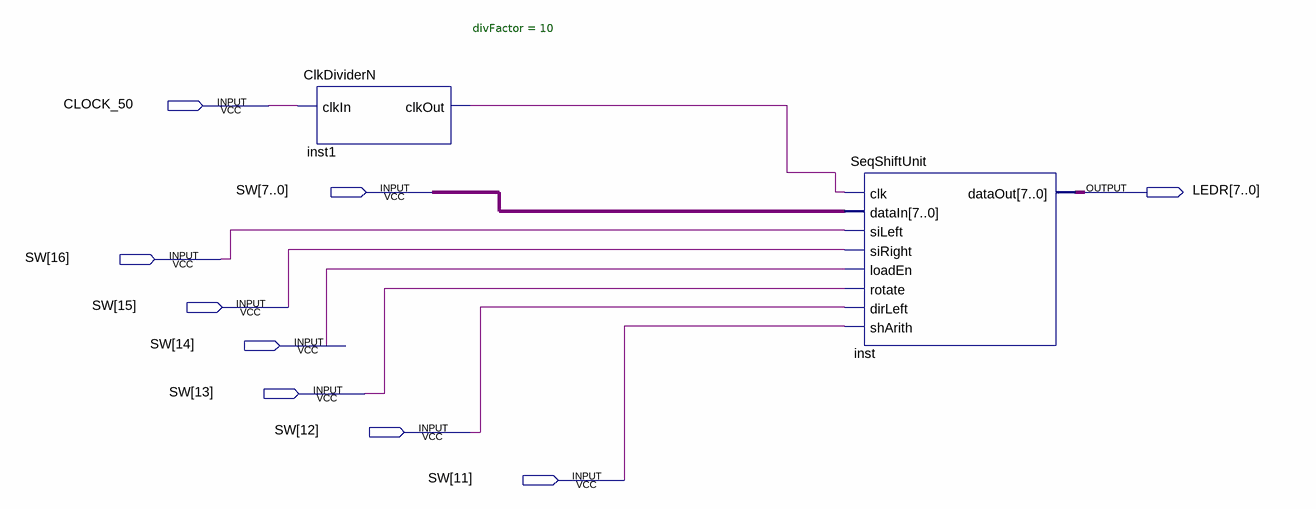
[diagram p0: schematic sheet]
// Quartus schematic SeqShiftUnit_Demo.bdf as structural Verilog: 2 symbols, 9 pins
module SeqShiftUnit_Demo (
  input  CLOCK_50,
  input  [16:0] SW,
  output [7:0] LEDR
);

  wire inst1_clkout;

  ClkDividerN #(.divFactor(10)) inst1 (.clkIn(CLOCK_50), .clkOut(inst1_clkout));
  SeqShiftUnit inst (
    .clk(inst1_clkout), .dataIn(SW[7:0]), .siLeft(SW[16]), .siRight(SW[15]), .loadEn(SW[14]),
    .rotate(SW[13]), .dirLeft(SW[12]), .shArith(SW[11]), .dataOut(LEDR));
endmodule
